# EAGLE design Cup_and_Wash_v2_relay (EAGLE 8.5.1)
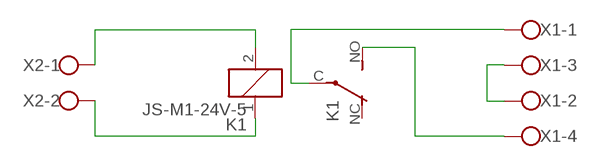
[diagram p0: schematic, sheet 1]

## Parts
K1  JS-M1-24V-5  JS-M1-12V-5  [JS-M]
X1  W237-4  [W237-4]
X2  W237-102  [W237-102]

## Nets
N$1: K1.2 X2.1
N$2: K1.1 X2.2
N$3: K1.C(2:P) X1.1
N$4: X1.2 X1.3
N$5: K1.NO(2:S) X1.4
Unconnected: K1.NC(2:O)

## Library data of the parts
K1 = relay:JS-M1*: Automotive Ultra-Miniature Power Relay NAiS Source: http://www.mew-europe.com/.. en_ds_61211_0000.pdf; MF: FARNELL; MPN: JSM1-12V-5; OC_FARNELL: 910351; OC_NEWARK: 14J1764
X1 = con-wago-500:W237-4: WAGO SCREW CLAMP; OC_FARNELL: unknown; OC_NEWARK: unknown
X2 = con-wago-500:W237-102: WAGO SCREW CLAMP; MPN: 237-102; OC_FARNELL: unknown; OC_NEWARK: 70K9898

## Board
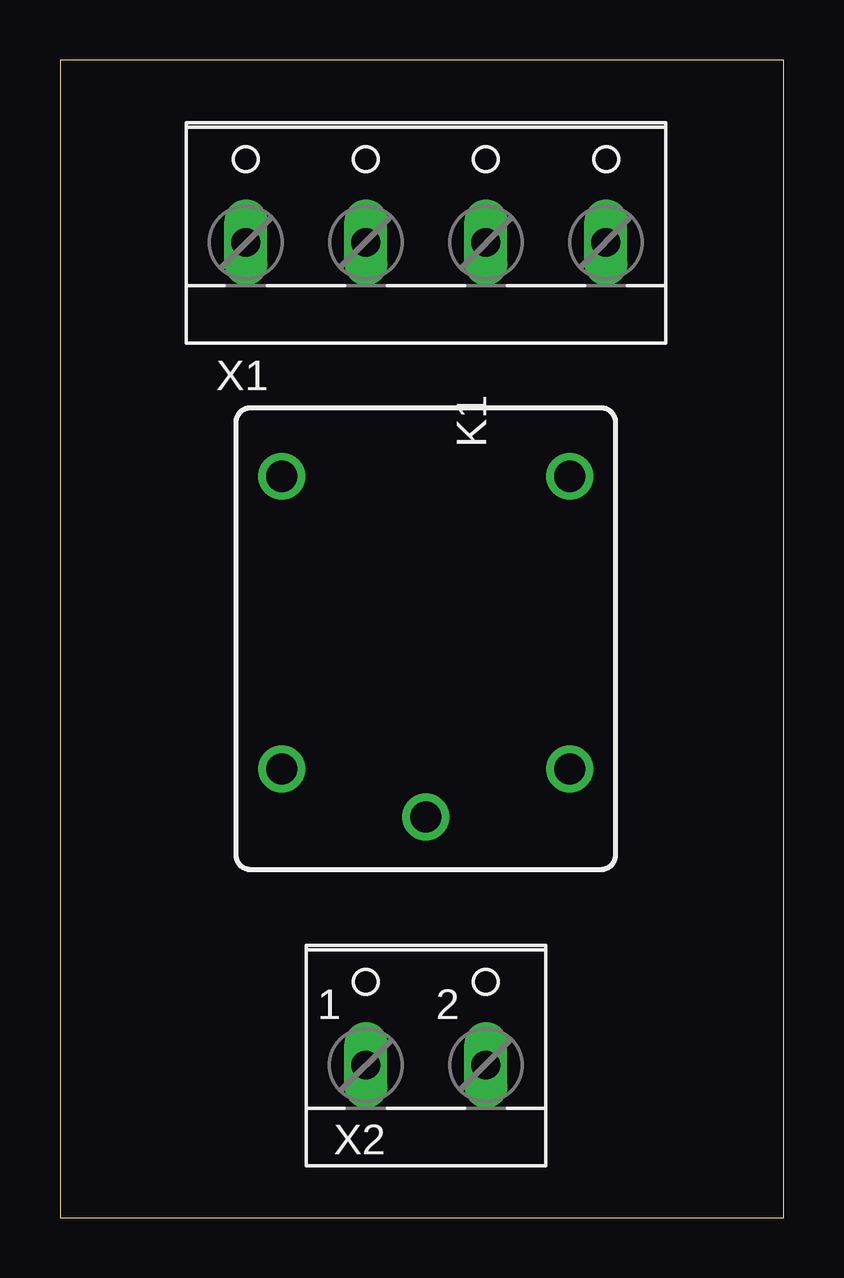
[diagram p1: board, top side]
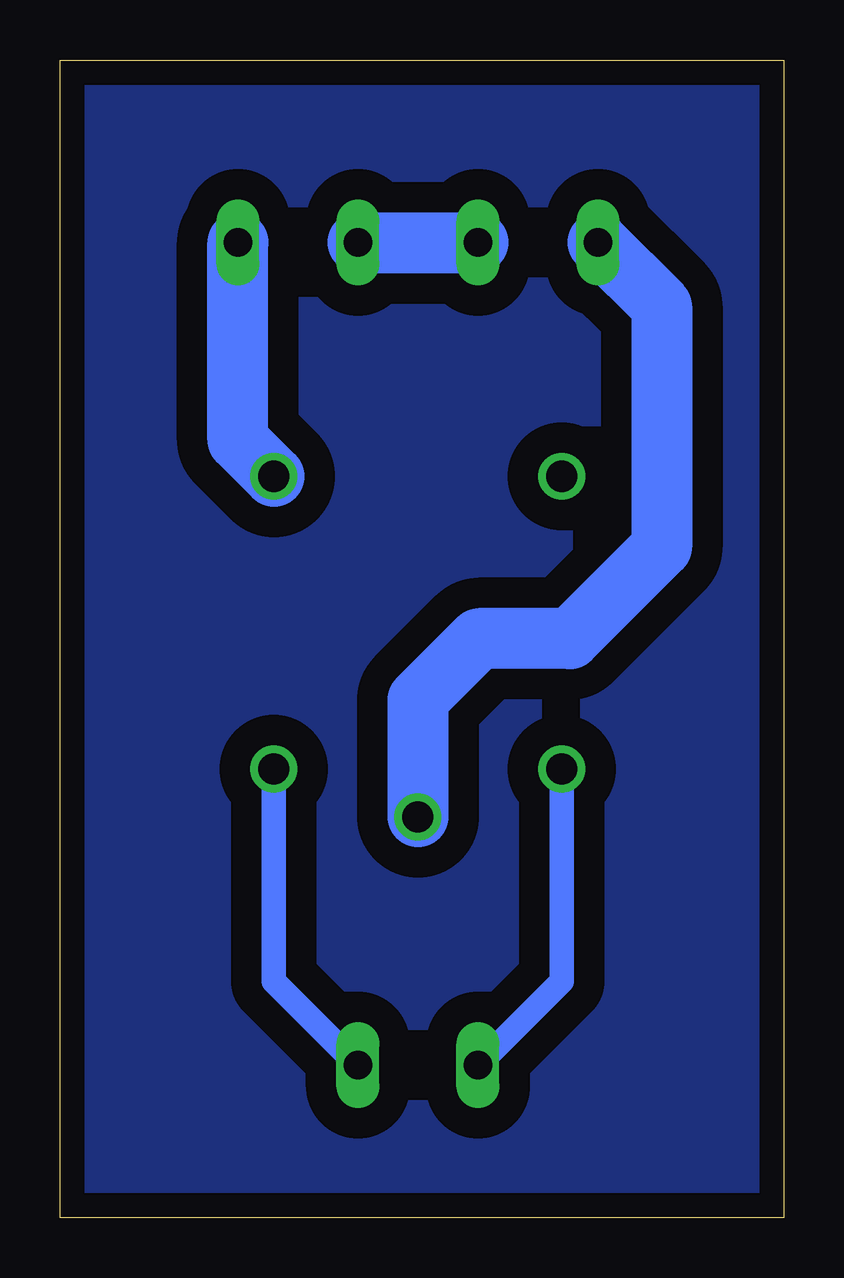
[diagram p2: board, bottom side, seen from below]

Size 30.15 x 48.25 mm. Coordinates in mm from the lower left corner, seen from the top.
Outline: 0,0 30.15,0 30.15,48.25 0,48.25 0,0
Copper layers (1*16): Top 0.035mm / dielectric 1.5mm / Bottom 0.035mm
Design rules "default *": minimum track width 6mil, minimum drill 0.35mm, track to track 50mil, track to pad 50mil, pad to pad 6mil, via to via 6mil, smd to smd 6mil, copper to edge 40mil, drill to drill 6mil, minimum pad ring 10mil, minimum via ring 8mil, stop-mask expansion 4mil, vias tented up to drill 0mil, thermal gap 10mil

### Footprints (pad centres in the part's own frame; a part is rotated, then mirrored left to right if it is on the bottom)
JS-M = drill 1.3: 1 6.7,6; 2 6.7,-6; C 8.7,0; NC -5.5,-6; NO -5.5,6
W237-4 = drill 1.194 long: 1 -7.5,-1.27; 2 -2.5,-1.27; 3 2.5,-1.27; 4 7.5,-1.27
W237-102 = drill 1.194 long: 1 -2.5,-1.27; 2 2.5,-1.27

### Placement (x,y rotation side)
K1  15.24,25.4 270 top
X1  15.24,41.91 0 top
X2  15.24,7.62 0 top

### Tracks (layer width: path | path; a pad name or v marks a point on that pad's centre or on a via)
GND
  pour Bottom: 0,48.26 30.48,48.26 30.48,1.27 29.21,0 24.13,0 1.27,0 0,1.27
N$1
  Bottom 1.016: X2.1 9.24,9.85 K1.2
N$2
  Bottom 1.016: K1.1 21.24,9.85 X2.2
N$3
  Bottom 2.54: X1.1 5.08,37.98 5.08,27.94 8.89,24.13 12.7,24.13 15.24,21.59 K1.C
N$4
  Bottom 2.54: X1.3 X1.2
N$5
  Bottom 2.54: K1.NO 22.74,32.4 X1.4